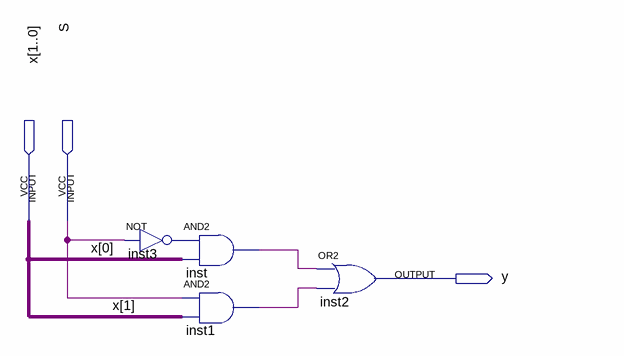
[diagram p0: schematic sheet]
// Quartus schematic MuxDemo.bdf as structural Verilog: 4 symbols, 3 pins
module MuxDemo (
  input  [1:0] x,
  input  S,
  output y
);

  wire inst1_out, inst3_out, inst_out;

  not inst3 (inst3_out, S);
  and inst (inst_out, inst3_out, x[0]);
  and inst1 (inst1_out, S, x[1]);
  or inst2 (y, inst_out, inst1_out);
endmodule
